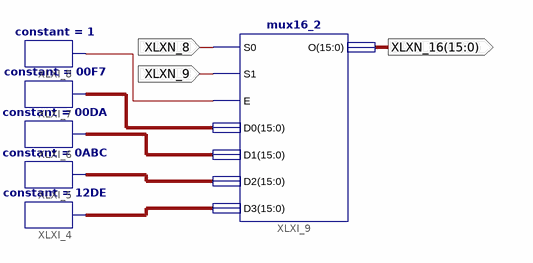
[diagram p0: schematic sheet 1]
// Xilinx ISE schematic test.sch (spartan3e) as structural Verilog: 6 symbols, 3 ports
module test (
  input  XLXN_8,
  input  XLXN_9,
  output [15:0] XLXN_16
);

  wire XLXN_10;
  wire [15:0] XLXN_17, XLXN_18, XLXN_19, XLXN_20;

  constant #(.CValue("12DE")) XLXI_4 (.O(XLXN_20));
  constant #(.CValue("0ABC")) XLXI_5 (.O(XLXN_19));
  constant #(.CValue("00DA")) XLXI_6 (.O(XLXN_18));
  constant #(.CValue("00F7")) XLXI_7 (.O(XLXN_17));
  constant #(.CValue("1")) XLXI_8 (.O(XLXN_10));
  mux16_2 XLXI_9 (
    .D0(XLXN_17), .D1(XLXN_18), .D2(XLXN_19), .D3(XLXN_20), .O(XLXN_16), .S1(XLXN_9), .E(XLXN_10), .S0(XLXN_8));
endmodule
